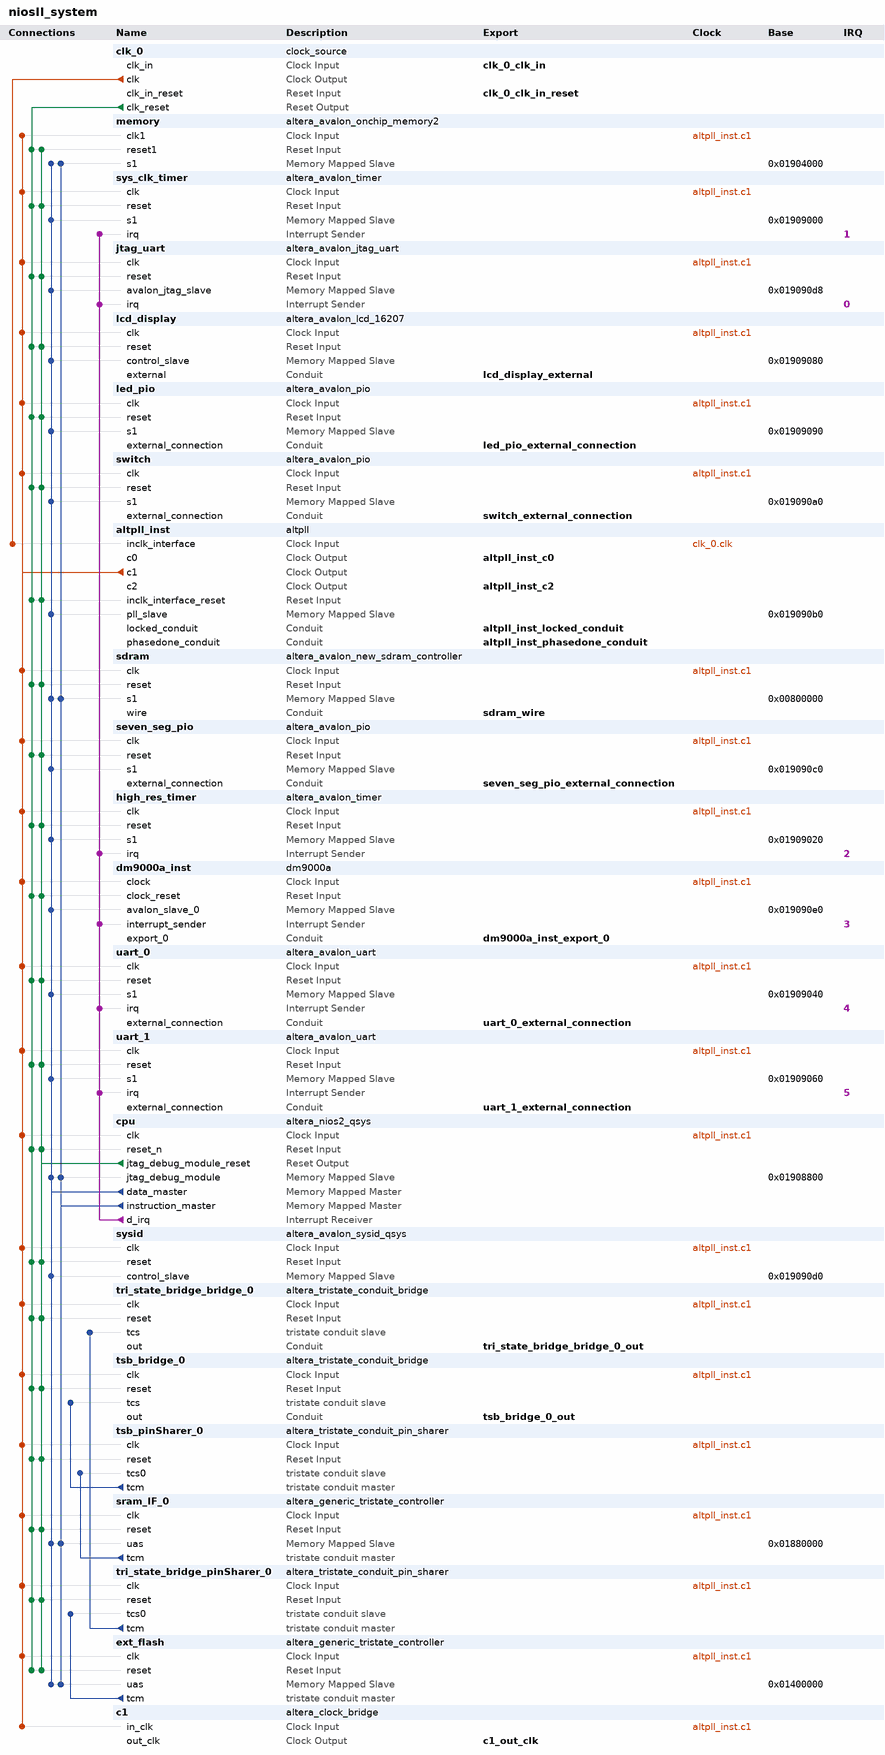
[diagram p0: system contents]
# Platform Designer (Qsys) system niosII_system, Cyclone II EP2C35F672C6
# Parameters at their usual value, and those the tool derives, are not listed.
package require -exact qsys 12.1
create_system niosII_system
set_project_property DEVICE_FAMILY {Cyclone II}
set_project_property DEVICE EP2C35F672C6

add_instance clk_0 clock_source 12.1
set_instance_parameter_value clk_0 clockFrequency 50000000

add_instance memory altera_avalon_onchip_memory2 12.1
set_instance_parameter_value memory dataWidth 32
set_instance_parameter_value memory dualPort false
set_instance_parameter_value memory initMemContent true
set_instance_parameter_value memory initializationFileName memory
set_instance_parameter_value memory memorySize 16384

add_instance sys_clk_timer altera_avalon_timer 12.1
set_instance_parameter_value sys_clk_timer period 1
set_instance_parameter_value sys_clk_timer periodUnits MSEC
set_instance_parameter_value sys_clk_timer timerPreset CUSTOM

add_instance jtag_uart altera_avalon_jtag_uart 12.1
set_instance_parameter_value jtag_uart simInteractiveOptions INTERACTIVE_INPUT_OUTPUT

add_instance lcd_display altera_avalon_lcd_16207 12.1

add_instance led_pio altera_avalon_pio 12.1
set_instance_parameter_value led_pio direction Output
set_instance_parameter_value led_pio width 8

add_instance switch altera_avalon_pio 12.1
set_instance_parameter_value switch direction Input
set_instance_parameter_value switch simDoTestBenchWiring true
set_instance_parameter_value switch width 8

add_instance altpll_inst altpll 12.1
set_instance_parameter_value altpll_inst INCLK0_INPUT_FREQUENCY 20000
set_instance_parameter_value altpll_inst COMPENSATE_CLOCK CLK1
set_instance_parameter_value altpll_inst GATE_LOCK_SIGNAL NO
set_instance_parameter_value altpll_inst VALID_LOCK_MULTIPLIER 1
set_instance_parameter_value altpll_inst INVALID_LOCK_MULTIPLIER 5
set_instance_parameter_value altpll_inst CLK0_MULTIPLY_BY 2
set_instance_parameter_value altpll_inst CLK1_MULTIPLY_BY 2
set_instance_parameter_value altpll_inst CLK2_MULTIPLY_BY 1
set_instance_parameter_value altpll_inst CLK0_DIVIDE_BY 1
set_instance_parameter_value altpll_inst CLK1_DIVIDE_BY 1
set_instance_parameter_value altpll_inst CLK2_DIVIDE_BY 2
set_instance_parameter_value altpll_inst CLK0_PHASE_SHIFT -3000
set_instance_parameter_value altpll_inst CLK1_PHASE_SHIFT 0
set_instance_parameter_value altpll_inst CLK2_PHASE_SHIFT 0
set_instance_parameter_value altpll_inst CLK1_DUTY_CYCLE 50
set_instance_parameter_value altpll_inst CLK2_DUTY_CYCLE 50
set_instance_parameter_value altpll_inst PORT_clk1 PORT_USED
set_instance_parameter_value altpll_inst PORT_clk2 PORT_USED
set_instance_parameter_value altpll_inst PORT_clk3 PORT_UNUSED
set_instance_parameter_value altpll_inst PORT_ARESET PORT_UNUSED
set_instance_parameter_value altpll_inst PORT_LOCKED PORT_UNUSED

add_instance sdram altera_avalon_new_sdram_controller 12.1
set_instance_parameter_value sdram TAC 5.5
set_instance_parameter_value sdram TRCD 20.0
set_instance_parameter_value sdram TRP 20.0
set_instance_parameter_value sdram casLatency 3
set_instance_parameter_value sdram columnWidth 8
set_instance_parameter_value sdram dataWidth 16
set_instance_parameter_value sdram generateSimulationModel false
set_instance_parameter_value sdram model custom
set_instance_parameter_value sdram numberOfBanks 4
set_instance_parameter_value sdram numberOfChipSelects 1
set_instance_parameter_value sdram powerUpDelay 100.0
set_instance_parameter_value sdram refreshPeriod 15.625
set_instance_parameter_value sdram rowWidth 12

add_instance seven_seg_pio altera_avalon_pio 12.1
set_instance_parameter_value seven_seg_pio direction Output
set_instance_parameter_value seven_seg_pio width 16

add_instance high_res_timer altera_avalon_timer 12.1
set_instance_parameter_value high_res_timer period 10
set_instance_parameter_value high_res_timer periodUnits USEC
set_instance_parameter_value high_res_timer timerPreset FULL_FEATURED

add_instance dm9000a_inst dm9000a 7.2

add_instance uart_0 altera_avalon_uart 12.1
set_instance_parameter_value uart_0 baud 38400
set_instance_parameter_value uart_0 dataBits 8
set_instance_parameter_value uart_0 fixedBaud true
set_instance_parameter_value uart_0 parity NONE
set_instance_parameter_value uart_0 stopBits 1

add_instance uart_1 altera_avalon_uart 12.1
set_instance_parameter_value uart_1 baud 38400
set_instance_parameter_value uart_1 dataBits 8
set_instance_parameter_value uart_1 fixedBaud true
set_instance_parameter_value uart_1 parity NONE
set_instance_parameter_value uart_1 stopBits 1

add_instance cpu altera_nios2_qsys 12.1
set_instance_parameter_value cpu manuallyAssignCpuID false
set_instance_parameter_value cpu resetSlave ext_flash.uas
set_instance_parameter_value cpu exceptionSlave memory.s1
set_instance_parameter_value cpu breakSlave cpu.jtag_debug_module
set_instance_parameter_value cpu impl Fast
set_instance_parameter_value cpu icache_size 8192
set_instance_parameter_value cpu icache_burstType Sequential
set_instance_parameter_value cpu dcache_bursts true
set_instance_parameter_value cpu dcache_size 8192

add_instance sysid altera_avalon_sysid_qsys 12.1
set_instance_parameter_value sysid id 0

add_instance tri_state_bridge_bridge_0 altera_tristate_conduit_bridge 12.1

add_instance tsb_bridge_0 altera_tristate_conduit_bridge 12.1

add_instance tsb_pinSharer_0 altera_tristate_conduit_pin_sharer 12.1
set_instance_parameter_value tsb_pinSharer_0 NUM_INTERFACES 1
set_instance_parameter_value tsb_pinSharer_0 MODULE_ORIGIN_LIST sram_IF_0.tcm,sram_IF_0.tcm,sram_IF_0.tcm,sram_IF_0.tcm,sram_IF_0.tcm,sram_IF_0.tcm
set_instance_parameter_value tsb_pinSharer_0 SIGNAL_ORIGIN_LIST address,outputenable_n,byteenable_n,write_n,data,chipselect_n
set_instance_parameter_value tsb_pinSharer_0 SHARED_SIGNAL_LIST ats_tsb_address_to_the_sram_IF_0,ats_tsb_outputenable_n_to_the_sram_IF_0,ats_tsb_byteenable_n_to_the_sram_IF_0,ats_tsb_write_n_to_the_sram_IF_0,ats_tsb_data_to_and_from_the_sram_IF_0,ats_tsb_chipselect_n_to_the_sram_IF_0

add_instance sram_IF_0 altera_generic_tristate_controller 12.1
set_instance_parameter_value sram_IF_0 TCM_ADDRESS_W 19
set_instance_parameter_value sram_IF_0 TCM_DATA_W 16
set_instance_parameter_value sram_IF_0 TCM_BYTEENABLE_W 2
set_instance_parameter_value sram_IF_0 TCM_READ_WAIT 1
set_instance_parameter_value sram_IF_0 TCM_WRITE_WAIT 0
set_instance_parameter_value sram_IF_0 TCM_SETUP_WAIT 0
set_instance_parameter_value sram_IF_0 TCM_DATA_HOLD 0
set_instance_parameter_value sram_IF_0 TCM_MAX_PENDING_READ_TRANSACTIONS 3
set_instance_parameter_value sram_IF_0 TCM_TURNAROUND_TIME 2
set_instance_parameter_value sram_IF_0 TCM_TIMING_UNITS 1
set_instance_parameter_value sram_IF_0 TCM_READLATENCY 2
set_instance_parameter_value sram_IF_0 TCM_SYMBOLS_PER_WORD 2
set_instance_parameter_value sram_IF_0 USE_READ 0
set_instance_parameter_value sram_IF_0 USE_BEGINTRANSFER 0
set_instance_parameter_value sram_IF_0 USE_BYTEENABLE 1
set_instance_parameter_value sram_IF_0 USE_OUTPUTENABLE 1
set_instance_parameter_value sram_IF_0 ACTIVE_LOW_READ 0
set_instance_parameter_value sram_IF_0 ACTIVE_LOW_BYTEENABLE 1
set_instance_parameter_value sram_IF_0 ACTIVE_LOW_OUTPUTENABLE 1
set_instance_parameter_value sram_IF_0 ACTIVE_LOW_BEGINTRANSFER 0
set_instance_parameter_value sram_IF_0 CHIPSELECT_THROUGH_READLATENCY 0
set_instance_parameter_value sram_IF_0 IS_MEMORY_DEVICE 0
set_instance_parameter_value sram_IF_0 MODULE_ASSIGNMENT_KEYS embeddedsw.configuration.hwClassnameDriverSupportList
set_instance_parameter_value sram_IF_0 MODULE_ASSIGNMENT_VALUES altera_avalon_lan91c111:altera_avalon_cfi_flash
set_instance_parameter_value sram_IF_0 INTERFACE_ASSIGNMENT_KEYS embeddedsw.configuration.isFlash,embeddedsw.configuration.isMemoryDevice,embeddedsw.configuration.isNonVolatileStorage,embeddedsw.configuration.isPrintableDevice
set_instance_parameter_value sram_IF_0 INTERFACE_ASSIGNMENT_VALUES 0,0,0,0

add_instance tri_state_bridge_pinSharer_0 altera_tristate_conduit_pin_sharer 12.1
set_instance_parameter_value tri_state_bridge_pinSharer_0 NUM_INTERFACES 1
set_instance_parameter_value tri_state_bridge_pinSharer_0 MODULE_ORIGIN_LIST ext_flash.tcm,ext_flash.tcm,ext_flash.tcm,ext_flash.tcm,ext_flash.tcm
set_instance_parameter_value tri_state_bridge_pinSharer_0 SHARED_SIGNAL_LIST address_to_the_ext_flash,read_n_to_the_ext_flash,write_n_to_the_ext_flash,data_to_and_from_the_ext_flash,select_n_to_the_ext_flash

add_instance ext_flash altera_generic_tristate_controller 12.1
set_instance_parameter_value ext_flash TCM_ADDRESS_W 22
set_instance_parameter_value ext_flash TCM_DATA_W 8
set_instance_parameter_value ext_flash TCM_BYTEENABLE_W 1
set_instance_parameter_value ext_flash TCM_READ_WAIT 160
set_instance_parameter_value ext_flash TCM_WRITE_WAIT 160
set_instance_parameter_value ext_flash TCM_SETUP_WAIT 40
set_instance_parameter_value ext_flash TCM_DATA_HOLD 40
set_instance_parameter_value ext_flash TCM_MAX_PENDING_READ_TRANSACTIONS 3
set_instance_parameter_value ext_flash TCM_TURNAROUND_TIME 2
set_instance_parameter_value ext_flash TCM_TIMING_UNITS 0
set_instance_parameter_value ext_flash TCM_READLATENCY 2
set_instance_parameter_value ext_flash TCM_SYMBOLS_PER_WORD 1
set_instance_parameter_value ext_flash USE_READ 1
set_instance_parameter_value ext_flash USE_BEGINTRANSFER 0
set_instance_parameter_value ext_flash USE_BYTEENABLE 0
set_instance_parameter_value ext_flash USE_OUTPUTENABLE 0
set_instance_parameter_value ext_flash ACTIVE_LOW_READ 1
set_instance_parameter_value ext_flash ACTIVE_LOW_BYTEENABLE 0
set_instance_parameter_value ext_flash ACTIVE_LOW_OUTPUTENABLE 0
set_instance_parameter_value ext_flash ACTIVE_LOW_BEGINTRANSFER 0
set_instance_parameter_value ext_flash CHIPSELECT_THROUGH_READLATENCY 0
set_instance_parameter_value ext_flash MODULE_ASSIGNMENT_KEYS embeddedsw.configuration.hwClassnameDriverSupportList,embeddedsw.configuration.hwClassnameDriverSupportDefault,embeddedsw.CMacro.SETUP_VALUE,embeddedsw.CMacro.WAIT_VALUE,embeddedsw.CMacro.HOLD_VALUE,embeddedsw.CMacro.TIMING_UNITS,embeddedsw.CMacro.SIZE,embeddedsw.memoryInfo.MEM_INIT_DATA_WIDTH,embeddedsw.memoryInfo.HAS_BYTE_LANE,embeddedsw.memoryInfo.IS_FLASH,embeddedsw.memoryInfo.GENERATE_DAT_SYM,embeddedsw.memoryInfo.GENERATE_FLASH,embeddedsw.memoryInfo.DAT_SYM_INSTALL_DIR,embeddedsw.memoryInfo.FLASH_INSTALL_DIR
set_instance_parameter_value ext_flash MODULE_ASSIGNMENT_VALUES {altera_avalon_lan91c111:altera_avalon_cfi_flash,altera_avalon_cfi_flash,40,160,40,"ns",4194304u,8,0,1,1,1,SIM_DIR,APP_DIR}
set_instance_parameter_value ext_flash INTERFACE_ASSIGNMENT_KEYS embeddedsw.configuration.isFlash,embeddedsw.configuration.isMemoryDevice,embeddedsw.configuration.isNonVolatileStorage
set_instance_parameter_value ext_flash INTERFACE_ASSIGNMENT_VALUES 1,1,1

add_instance c1 altera_clock_bridge 12.1
set_instance_parameter_value c1 DERIVED_CLOCK_RATE 100000000
set_instance_parameter_value c1 EXPLICIT_CLOCK_RATE 0

# connections
add_connection altpll_inst.c1 c1.in_clk clock
add_connection altpll_inst.c1 cpu.clk clock
add_connection altpll_inst.c1 dm9000a_inst.clock clock
add_connection altpll_inst.c1 ext_flash.clk clock
add_connection altpll_inst.c1 high_res_timer.clk clock
add_connection altpll_inst.c1 jtag_uart.clk clock
add_connection altpll_inst.c1 lcd_display.clk clock
add_connection altpll_inst.c1 led_pio.clk clock
add_connection altpll_inst.c1 memory.clk1 clock
add_connection altpll_inst.c1 sdram.clk clock
add_connection altpll_inst.c1 seven_seg_pio.clk clock
add_connection altpll_inst.c1 sram_IF_0.clk clock
add_connection altpll_inst.c1 switch.clk clock
add_connection altpll_inst.c1 sys_clk_timer.clk clock
add_connection altpll_inst.c1 sysid.clk clock
add_connection altpll_inst.c1 tri_state_bridge_bridge_0.clk clock
add_connection altpll_inst.c1 tri_state_bridge_pinSharer_0.clk clock
add_connection altpll_inst.c1 tsb_bridge_0.clk clock
add_connection altpll_inst.c1 tsb_pinSharer_0.clk clock
add_connection altpll_inst.c1 uart_0.clk clock
add_connection altpll_inst.c1 uart_1.clk clock
add_connection clk_0.clk altpll_inst.inclk_interface clock
add_connection clk_0.clk_reset altpll_inst.inclk_interface_reset reset
add_connection clk_0.clk_reset cpu.reset_n reset
add_connection clk_0.clk_reset dm9000a_inst.clock_reset reset
add_connection clk_0.clk_reset ext_flash.reset reset
add_connection clk_0.clk_reset high_res_timer.reset reset
add_connection clk_0.clk_reset jtag_uart.reset reset
add_connection clk_0.clk_reset lcd_display.reset reset
add_connection clk_0.clk_reset led_pio.reset reset
add_connection clk_0.clk_reset memory.reset1 reset
add_connection clk_0.clk_reset sdram.reset reset
add_connection clk_0.clk_reset seven_seg_pio.reset reset
add_connection clk_0.clk_reset sram_IF_0.reset reset
add_connection clk_0.clk_reset switch.reset reset
add_connection clk_0.clk_reset sys_clk_timer.reset reset
add_connection clk_0.clk_reset sysid.reset reset
add_connection clk_0.clk_reset tri_state_bridge_bridge_0.reset reset
add_connection clk_0.clk_reset tri_state_bridge_pinSharer_0.reset reset
add_connection clk_0.clk_reset tsb_bridge_0.reset reset
add_connection clk_0.clk_reset tsb_pinSharer_0.reset reset
add_connection clk_0.clk_reset uart_0.reset reset
add_connection clk_0.clk_reset uart_1.reset reset
add_connection cpu.jtag_debug_module_reset altpll_inst.inclk_interface_reset reset
add_connection cpu.jtag_debug_module_reset cpu.reset_n reset
add_connection cpu.jtag_debug_module_reset dm9000a_inst.clock_reset reset
add_connection cpu.jtag_debug_module_reset ext_flash.reset reset
add_connection cpu.jtag_debug_module_reset high_res_timer.reset reset
add_connection cpu.jtag_debug_module_reset jtag_uart.reset reset
add_connection cpu.jtag_debug_module_reset lcd_display.reset reset
add_connection cpu.jtag_debug_module_reset led_pio.reset reset
add_connection cpu.jtag_debug_module_reset memory.reset1 reset
add_connection cpu.jtag_debug_module_reset sdram.reset reset
add_connection cpu.jtag_debug_module_reset seven_seg_pio.reset reset
add_connection cpu.jtag_debug_module_reset sram_IF_0.reset reset
add_connection cpu.jtag_debug_module_reset switch.reset reset
add_connection cpu.jtag_debug_module_reset sys_clk_timer.reset reset
add_connection cpu.jtag_debug_module_reset sysid.reset reset
add_connection cpu.jtag_debug_module_reset tri_state_bridge_bridge_0.reset reset
add_connection cpu.jtag_debug_module_reset tri_state_bridge_pinSharer_0.reset reset
add_connection cpu.jtag_debug_module_reset tsb_bridge_0.reset reset
add_connection cpu.jtag_debug_module_reset tsb_pinSharer_0.reset reset
add_connection cpu.jtag_debug_module_reset uart_0.reset reset
add_connection cpu.jtag_debug_module_reset uart_1.reset reset
add_connection cpu.data_master altpll_inst.pll_slave avalon
set_connection_parameter_value cpu.data_master/altpll_inst.pll_slave baseAddress 0x019090b0
add_connection cpu.data_master cpu.jtag_debug_module avalon
set_connection_parameter_value cpu.data_master/cpu.jtag_debug_module baseAddress 0x01908800
add_connection cpu.data_master dm9000a_inst.avalon_slave_0 avalon
set_connection_parameter_value cpu.data_master/dm9000a_inst.avalon_slave_0 baseAddress 0x019090e0
add_connection cpu.data_master ext_flash.uas avalon
set_connection_parameter_value cpu.data_master/ext_flash.uas baseAddress 0x01400000
add_connection cpu.data_master high_res_timer.s1 avalon
set_connection_parameter_value cpu.data_master/high_res_timer.s1 baseAddress 0x01909020
add_connection cpu.data_master jtag_uart.avalon_jtag_slave avalon
set_connection_parameter_value cpu.data_master/jtag_uart.avalon_jtag_slave baseAddress 0x019090d8
add_connection cpu.data_master lcd_display.control_slave avalon
set_connection_parameter_value cpu.data_master/lcd_display.control_slave baseAddress 0x01909080
add_connection cpu.data_master led_pio.s1 avalon
set_connection_parameter_value cpu.data_master/led_pio.s1 baseAddress 0x01909090
add_connection cpu.data_master memory.s1 avalon
set_connection_parameter_value cpu.data_master/memory.s1 baseAddress 0x01904000
add_connection cpu.data_master sdram.s1 avalon
set_connection_parameter_value cpu.data_master/sdram.s1 baseAddress 0x00800000
add_connection cpu.data_master seven_seg_pio.s1 avalon
set_connection_parameter_value cpu.data_master/seven_seg_pio.s1 baseAddress 0x019090c0
add_connection cpu.data_master sram_IF_0.uas avalon
set_connection_parameter_value cpu.data_master/sram_IF_0.uas baseAddress 0x01880000
add_connection cpu.data_master switch.s1 avalon
set_connection_parameter_value cpu.data_master/switch.s1 baseAddress 0x019090a0
add_connection cpu.data_master sys_clk_timer.s1 avalon
set_connection_parameter_value cpu.data_master/sys_clk_timer.s1 baseAddress 0x01909000
add_connection cpu.data_master sysid.control_slave avalon
set_connection_parameter_value cpu.data_master/sysid.control_slave baseAddress 0x019090d0
add_connection cpu.data_master uart_0.s1 avalon
set_connection_parameter_value cpu.data_master/uart_0.s1 baseAddress 0x01909040
add_connection cpu.data_master uart_1.s1 avalon
set_connection_parameter_value cpu.data_master/uart_1.s1 baseAddress 0x01909060
add_connection cpu.instruction_master cpu.jtag_debug_module avalon
set_connection_parameter_value cpu.instruction_master/cpu.jtag_debug_module baseAddress 0x01908800
add_connection cpu.instruction_master ext_flash.uas avalon
set_connection_parameter_value cpu.instruction_master/ext_flash.uas baseAddress 0x01400000
add_connection cpu.instruction_master memory.s1 avalon
set_connection_parameter_value cpu.instruction_master/memory.s1 baseAddress 0x01904000
add_connection cpu.instruction_master sdram.s1 avalon
set_connection_parameter_value cpu.instruction_master/sdram.s1 baseAddress 0x00800000
add_connection cpu.instruction_master sram_IF_0.uas avalon
set_connection_parameter_value cpu.instruction_master/sram_IF_0.uas baseAddress 0x01880000
add_connection cpu.d_irq dm9000a_inst.interrupt_sender interrupt
set_connection_parameter_value cpu.d_irq/dm9000a_inst.interrupt_sender irqNumber 3
add_connection cpu.d_irq high_res_timer.irq interrupt
set_connection_parameter_value cpu.d_irq/high_res_timer.irq irqNumber 2
add_connection cpu.d_irq jtag_uart.irq interrupt
set_connection_parameter_value cpu.d_irq/jtag_uart.irq irqNumber 0
add_connection cpu.d_irq sys_clk_timer.irq interrupt
set_connection_parameter_value cpu.d_irq/sys_clk_timer.irq irqNumber 1
add_connection cpu.d_irq uart_0.irq interrupt
set_connection_parameter_value cpu.d_irq/uart_0.irq irqNumber 4
add_connection cpu.d_irq uart_1.irq interrupt
set_connection_parameter_value cpu.d_irq/uart_1.irq irqNumber 5
add_connection ext_flash.tcm tri_state_bridge_pinSharer_0.tcs0 tristate_conduit
add_connection sram_IF_0.tcm tsb_pinSharer_0.tcs0 tristate_conduit
add_connection tri_state_bridge_pinSharer_0.tcm tri_state_bridge_bridge_0.tcs tristate_conduit
add_connection tsb_pinSharer_0.tcm tsb_bridge_0.tcs tristate_conduit

# exported interfaces
add_interface c1_out_clk clock source
set_interface_property c1_out_clk EXPORT_OF c1.out_clk
add_interface altpll_inst_phasedone_conduit conduit end
set_interface_property altpll_inst_phasedone_conduit EXPORT_OF altpll_inst.phasedone_conduit
add_interface seven_seg_pio_external_connection conduit end
set_interface_property seven_seg_pio_external_connection EXPORT_OF seven_seg_pio.external_connection
add_interface clk_0_clk_in_reset reset sink
set_interface_property clk_0_clk_in_reset EXPORT_OF clk_0.clk_in_reset
add_interface switch_external_connection conduit end
set_interface_property switch_external_connection EXPORT_OF switch.external_connection
add_interface dm9000a_inst_export_0 conduit end
set_interface_property dm9000a_inst_export_0 EXPORT_OF dm9000a_inst.export_0
add_interface tsb_bridge_0_out conduit end
set_interface_property tsb_bridge_0_out EXPORT_OF tsb_bridge_0.out
add_interface altpll_inst_c0 clock source
set_interface_property altpll_inst_c0 EXPORT_OF altpll_inst.c0
add_interface altpll_inst_c2 clock source
set_interface_property altpll_inst_c2 EXPORT_OF altpll_inst.c2
add_interface uart_1_external_connection conduit end
set_interface_property uart_1_external_connection EXPORT_OF uart_1.external_connection
add_interface lcd_display_external conduit end
set_interface_property lcd_display_external EXPORT_OF lcd_display.external
add_interface led_pio_external_connection conduit end
set_interface_property led_pio_external_connection EXPORT_OF led_pio.external_connection
add_interface clk_0_clk_in clock sink
set_interface_property clk_0_clk_in EXPORT_OF clk_0.clk_in
add_interface sdram_wire conduit end
set_interface_property sdram_wire EXPORT_OF sdram.wire
add_interface altpll_inst_locked_conduit conduit end
set_interface_property altpll_inst_locked_conduit EXPORT_OF altpll_inst.locked_conduit
add_interface tri_state_bridge_bridge_0_out conduit end
set_interface_property tri_state_bridge_bridge_0_out EXPORT_OF tri_state_bridge_bridge_0.out
add_interface uart_0_external_connection conduit end
set_interface_property uart_0_external_connection EXPORT_OF uart_0.external_connection

save_system niosII_system.qsys
